# Altium schematic sheet Sensor de Vacuo Digital.SchDoc
size A3; Organization: Altium Limited; Address1: L3, 12a Rodborough Rd; Address2: Frenchs Forest; Address3: NSW; Address4: Australia 2086
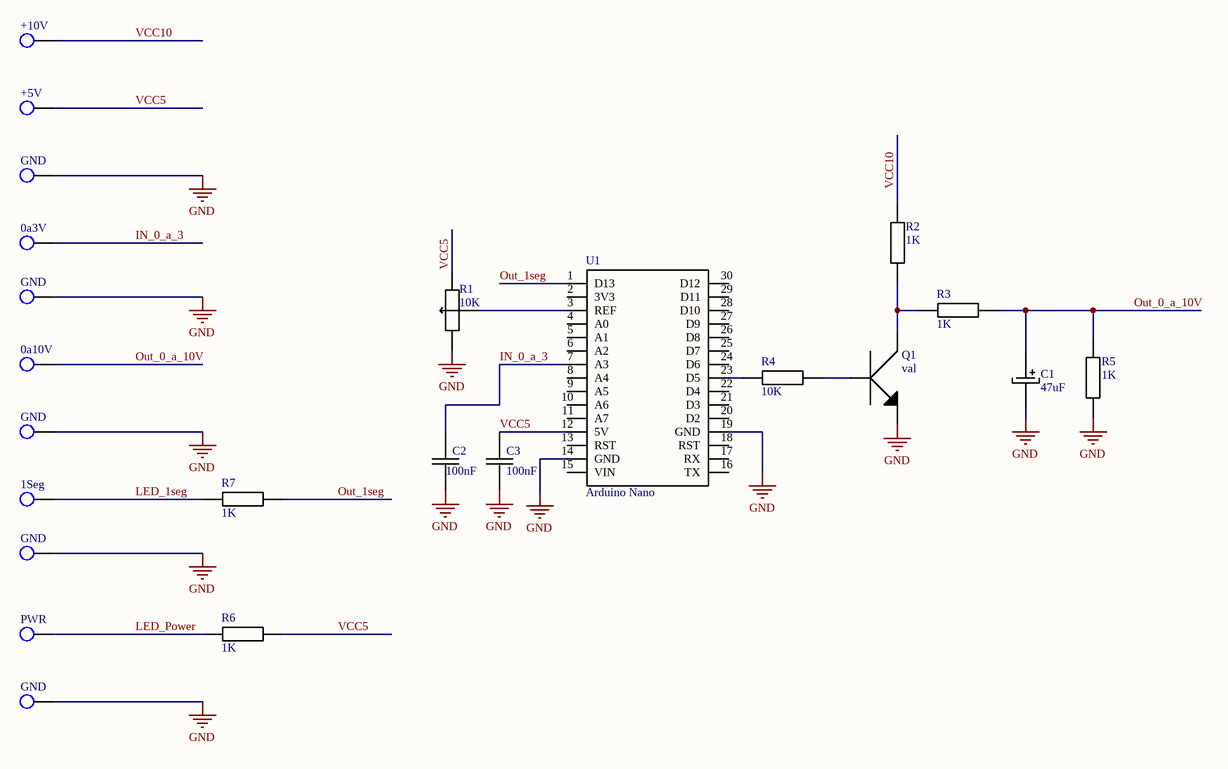
[diagram p0: Sensor de Vacuo Digital.SchDoc]

## Parts
(Parts that share a designator on the sheet are numbered #1, #2 ... from top to bottom, then left to right.)
0a3V  in(-)  [Ponto_de_Solda]  (value not drawn)  (no BOM)
0a10V  in(-)  [Ponto_de_Solda]  (value not drawn)  (no BOM)
1Seg  in(-)  [Ponto_de_Solda]  (value not drawn)  (no BOM)
+5V  in(-)  [Ponto_de_Solda]  (value not drawn)  (no BOM)
+10V  in(-)  [Ponto_de_Solda]  (value not drawn)  (no BOM)
C1  47uF  [Capacitor Eletrolitico 0.1]
C2  value 100nF  [CAPACITOR CERAMICO]  (hidden comment: val)
C3  value 100nF  [CAPACITOR CERAMICO]  (hidden comment: val)
GND#1  in(-)  [Ponto_de_Solda]  (value not drawn)  (no BOM)
GND#2  in(-)  [Ponto_de_Solda]  (value not drawn)  (no BOM)
GND#3  in(-)  [Ponto_de_Solda]  (value not drawn)  (no BOM)
GND#4  in(-)  [Ponto_de_Solda]  (value not drawn)  (no BOM)
GND#5  in(-)  [Ponto_de_Solda]  (value not drawn)  (no BOM)
PWR  in(-)  [Ponto_de_Solda]  (value not drawn)  (no BOM)
Q1  val  [TO-92 (C,B,E)]
R1  value 10K  [Trimpot Vertical]  (hidden comment: val)
R2  value 1K  [Resistor CR25 PTH]  (hidden comment: val)
R3  value 1K  [Resistor CR25 PTH]  (hidden comment: val)
R4  value 10K  [Resistor CR25 PTH]  (hidden comment: val)
R5  value 1K  [Resistor CR25 PTH]  (hidden comment: val)
R6  value 1K  [Resistor CR25 PTH]  (hidden comment: val)
R7  value 1K  [Resistor CR25 PTH]  (hidden comment: val)
U1  Arduino Nano  [ARDUINO NANO]

## Nets
GND: C1.2 C2.1 C3.1 GND#1.1(S?) GND#2.1(S?) GND#3.1(S?) GND#4.1(S?) GND#5.1(S?) Q1.E R1.1 R5.1 U1.14(GND) U1.19(GND)
IN_0_a_3: 0a3V.1(S?) C2.2 U1.7(A3)
LED_1seg: 1Seg.1(S?) R7.1
LED_Power: PWR.1(S?) R6.1
Out_0_a_10V: 0a10V.1(S?) C1.1 R3.2 R5.2
Out_1seg: R7.2 U1.1(D13)
VCC5: +5V.1(S?) C3.2 R1.3 R6.2 U1.12(5V)
VCC10: +10V.1(S?) R2.2
NetQ1_B: Q1.B R4.2
NetQ1_C: Q1.C R2.1 R3.1
NetR1_2: R1.2 U1.3(REF)
NetR4_1: R4.1 U1.23(D5)

Not connected (* = marked no-connect by the designer): U1 2(3V3) 4(A0) 5(A1) 6(A2) 8(A4) 9(A5) 10(A6) 11(A7) 13(RST) 15(VIN) 16(TX) 17(RX) 18(RST) 20(D2) 21(D3) 22(D4) 24(D6) 25(D7) 26(D8) 27(D9) 28(D10) 29(D11) 30(D12)

## Notes on the sheet
- Title
- Size:
- Date:
- A3
- Number:
- Time:
- Revision:
- Sheet
- of
- File:

## Library data of the parts
0a3V 0a10V 1Seg +5V +10V GND#1-GND#5 PWR = Ponto_de_Solda: Value: Ponto ...
C1 = Capacitor Eletrolítico
C2 C3 = Capacitor Cerâmico
Q1 = Transistor NPN
R1 = Trimpot
R2-R7 = Resistor